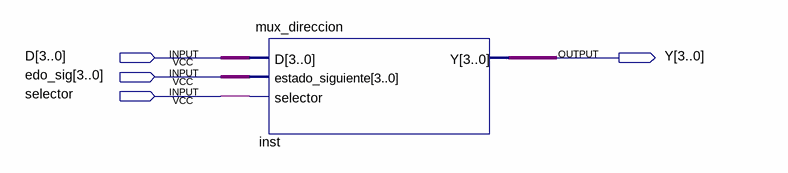
[diagram p0: schematic sheet]
// Quartus schematic muxdir.bdf as structural Verilog: 1 symbols, 4 pins
module muxdir (
  input  [3:0] D,
  input  [3:0] edo_sig,
  input  selector,
  output [3:0] Y
);

  mux_direccion inst (.D(D), .estado_siguiente(edo_sig), .selector(selector), .Y(Y));
endmodule
